# Altium schematic sheet ANALOG.SchDoc: ANALOG
size A3; CheckedBy: HungDV; DrawnBy: HungDV; SheetNumber: 4; SheetTotal: 5
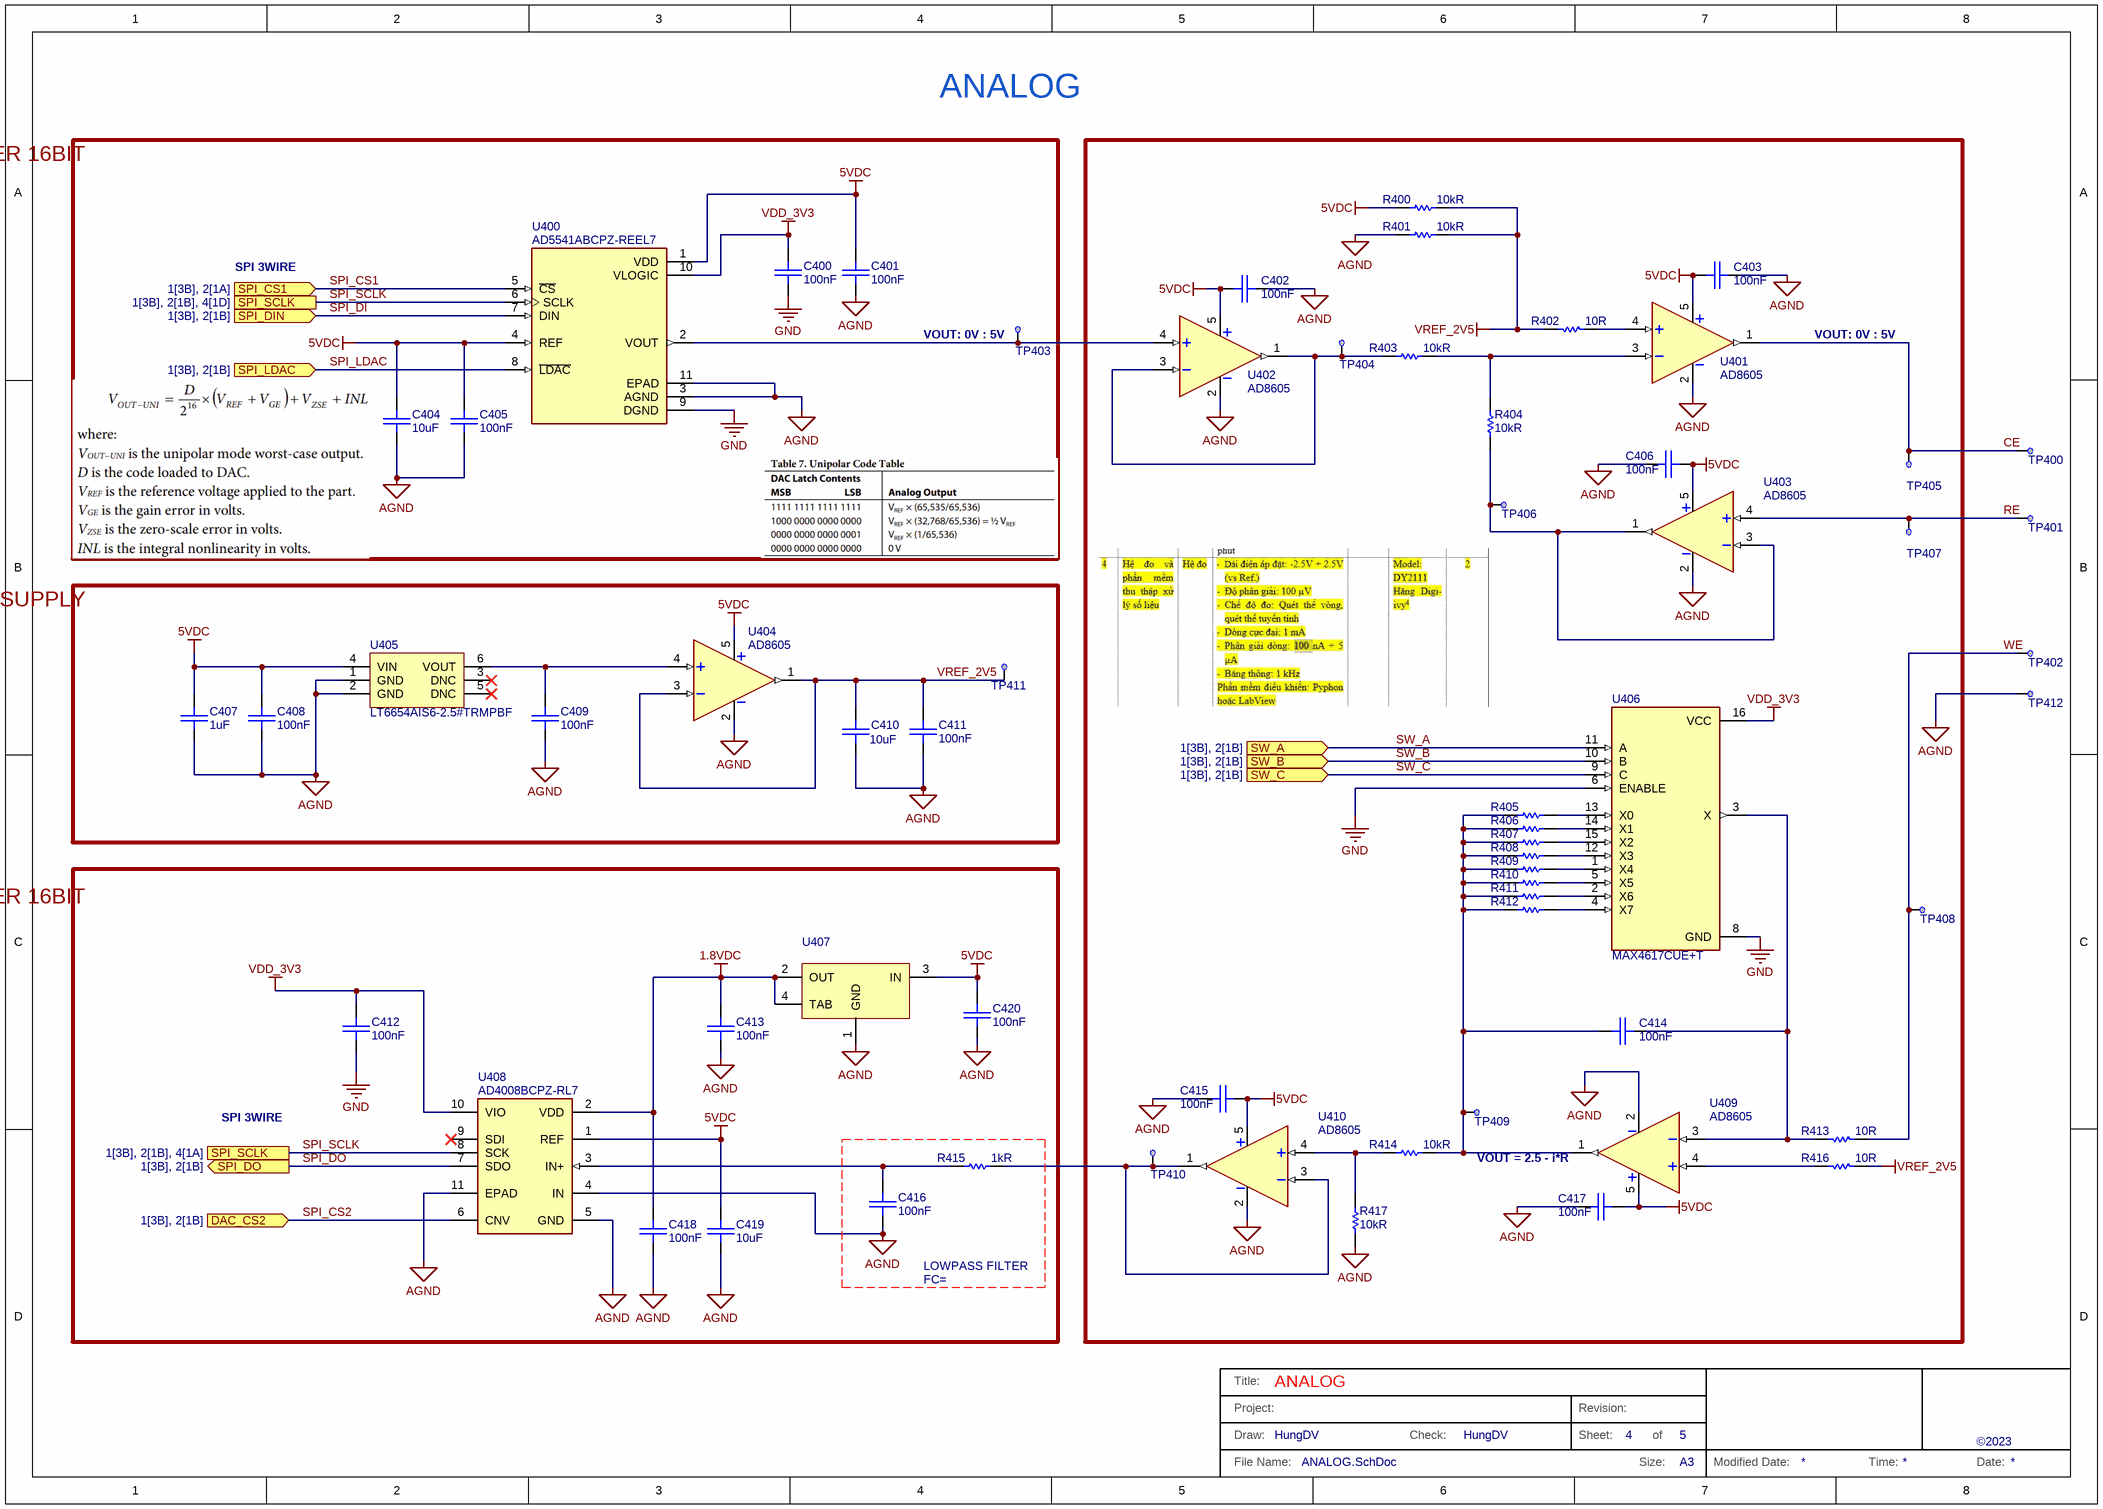
[diagram p0: ANALOG.SchDoc]

## Parts
C400  100nF  [CAP0603-M]
C401  100nF  [CAP0603-M]
C402  100nF  [CAP0603-M]
C403  100nF  [CAP0603-M]
C404  10uF  [CAP0603-M]
C405  100nF  [CAP0603-M]
C406  100nF  [CAP0603-M]
C407  Capacitance: 1uF  [CAP0603-M]  (hidden comment: 10uF)
C408  100nF  [CAP0603-M]
C409  100nF  [CAP0603-M]
C410  10uF  [CAP0603-M]
C411  100nF  [CAP0603-M]
C412  100nF  [CAP0603-M]
C413  100nF  [CAP0603-M]
C414  100nF  [CAP0603-M]
C415  100nF  [CAP0603-M]
C416  100nF  [CAP0603-M]
C417  100nF  [CAP0603-M]
C418  100nF  [CAP0603-M]
C419  10uF  [CAP0603-M]
C420  100nF  [CAP0603-M]
R400  10kR  [R_0603]
R401  10kR  [R_0603]
R402  10R  [R_0603]
R403  10kR  [R_0603]
R404  10kR  [R_0603]
R405  RES 11.3K OHM 1% 1/20W 0201  [R_0603]  (value not drawn)
R406  RES 11.3K OHM 1% 1/20W 0201  [R_0603]  (value not drawn)
R407  RES 11.3K OHM 1% 1/20W 0201  [R_0603]  (value not drawn)
R408  RES 11.3K OHM 1% 1/20W 0201  [R_0603]  (value not drawn)
R409  RES 11.3K OHM 1% 1/20W 0201  [R_0603]  (value not drawn)
R410  RES 11.3K OHM 1% 1/20W 0201  [R_0603]  (value not drawn)
R411  RES 11.3K OHM 1% 1/20W 0201  [R_0603]  (value not drawn)
R412  RES 11.3K OHM 1% 1/20W 0201  [R_0603]  (value not drawn)
R413  10R  [R_0603]
R414  10kR  [R_0603]
R415  1kR  [R_0603]
R416  10R  [R_0603]
R417  10kR  [R_0603]
TP400  SIREN_EN  [TPH]  (value not drawn)  (no BOM)
TP401  SIREN_EN  [TPH]  (value not drawn)  (no BOM)
TP402  SIREN_EN  [TPH]  (value not drawn)  (no BOM)
TP403  VDAC  [TPH]  (value not drawn)  (no BOM)
TP404  V1  [TPH]  (value not drawn)  (no BOM)
TP405  VCE  [TPH]  (value not drawn)  (no BOM)
TP406  VREFB  [TPH]  (value not drawn)  (no BOM)
TP407  VRE  [TPH]  (value not drawn)  (no BOM)
TP408  VWE  [TPH]  (value not drawn)  (no BOM)
TP409  VIR  [TPH]  (value not drawn)  (no BOM)
TP410  VADC  [TPH]  (value not drawn)  (no BOM)
TP411  VREF  [TPH]  (value not drawn)  (no BOM)
TP412  SIREN_EN  [TPH]  (value not drawn)  (no BOM)
U400  AD5541ABCPZ-REEL7  [SON50P300X300X80-11N]
U401  AD8605  [SOT95P280X145-5N]
U402  AD8605  [SOT95P280X145-5N]
U403  AD8605  [SOT95P280X145-5N]
U404  AD8605  [SOT95P280X145-5N]
U405  LT6654AIS6-2.5#TRMPBF  [SOT95P280X145-6N]
U406  MAX4617CUE+T  [TSOP65P640X110-16N]
U407  LM1117-3.3  [SOT223-4]  (value not drawn)
U408  AD4008BCPZ-RL7  [SON50P300X300X80-11N]
U409  AD8605  [SOT95P280X145-5N]
U410  AD8605  [SOT95P280X145-5N]

## Blocks framed on the sheet
DAC CONVERTER 16BIT: C400 C401 C404 C405 TP403 U400
VREF POWER SUPPLY: C407-C411 TP411 U404 U405
ADC CONVERTER 16BIT: C412 C413 C416 C418-C420 R415 U407 U408

## Ports
DAC_CS2 (in, see 1[3B], 2[1B]), SPI_CS1 (in, see 1[3B], 2[1A]), SPI_DIN (in, see 1[3B], 2[1B]), SPI_DO (out, see 1[3B], 2[1B]), SPI_LDAC (in, see 1[3B], 2[1B]), SPI_SCLK (see 1[3B], 2[1B], 4[1A]), SPI_SCLK (see 1[3B], 2[1B], 4[1D]), SW_A (in, see 1[3B], 2[1B]), SW_B (in, see 1[3B], 2[1B]), SW_C (in, see 1[3B], 2[1B])

## Nets
1.8VDC: C413.2 C418.2 U407.2(OUT) U407.4(TAB) U408.2(VDD)
5VDC: C401.2 C402.2 C403.2 C404.2 C405.2 C406.2 C407.2 C408.2 C415.2 C417.2 C419.2 C420.2 R400.2 U400.1(VDD) U400.4(REF) U401.5(V+) U402.5(V+) U403.5(V+) U404.5(V+) U405.4(VIN) U407.3(IN) U408.1(REF) U409.5(V+) U410.5(V+)
AGND: C401.1 C402.1 C403.1 C404.1 C405.1 C406.1 C407.1 C408.1 C409.1 C410.1 C411.1 C413.1 C415.1 C416.1 C417.1 C418.1 C419.1 C420.1 R401.2 R417.2 TP412.1(TP) U400.3(AGND) U400.11(EPAD) U401.2(V-) U402.2(V-) U403.2(V-) U404.2(V-) U405.1(GND) U405.2(GND) U407.1(GND) U408.4(IN) U408.5(GND) U408.11(EPAD) U409.2(V-) U410.2(V-)
GND: C400.1 C412.1 U400.9(DGND) U406.6(ENABLE) U406.8(GND)
VDD_3V3: C400.2 C412.2 U400.10(VLOGIC) U406.16(VCC) U408.10(VIO)
VREF_2V5: C410.2 C411.2 R400.1 R401.1 R402.1 R416.2 TP411.1(TP) U404.1(OUT) U404.3(+IN)
CE: TP400.1(TP) TP405.1(TP) U401.1(OUT)
RE: TP401.1(TP) TP407.1(TP) U403.4(-IN)
SPI_CS1: U400.5(~{CS}) ; port SPI_CS1
SPI_CS2: U408.6(CNV) ; port DAC_CS2
SPI_DI: U400.7(DIN) ; port SPI_DIN
SPI_DO: U408.7(SDO) ; port SPI_DO
SPI_LDAC: U400.8(~{LDAC}) ; port SPI_LDAC
SPI_SCLK: U400.6(SCLK) U408.8(SCK) ; port SPI_SCLK
SW_A: U406.11(A) ; port SW_A
SW_B: U406.10(B) ; port SW_B
SW_C: U406.9(C) ; port SW_C
WE: R413.2 TP402.1(TP) TP408.1(TP)
NetC409_2: C409.2 U404.4(-IN) U405.6(VOUT)
NetC414_1: C414.1 R413.1 U406.3(X) U409.3(+IN)
NetC414_2: C414.2 R405.2 R406.2 R407.2 R408.2 R409.2 R410.2 R411.2 R412.2 R414.1 TP409.1(TP) U409.1(OUT)
NetC416_2: C416.2 R415.2 U408.3(IN+)
NetR402_2: R402.2 U401.4(-IN)
NetR403_1: R403.1 R404.1 U401.3(+IN)
NetR403_2: R403.2 TP404.1(TP) U402.1(OUT) U402.3(+IN)
NetR404_2: R404.2 TP406.1(TP) U403.1(OUT) U403.3(+IN)
NetR405_1: R405.1 U406.13(X0)
NetR406_1: R406.1 U406.14(X1)
NetR407_1: R407.1 U406.15(X2)
NetR408_1: R408.1 U406.12(X3)
NetR409_1: R409.1 U406.1(X4)
NetR410_1: R410.1 U406.5(X5)
NetR411_1: R411.1 U406.2(X6)
NetR412_1: R412.1 U406.4(X7)
NetR414_2: R414.2 R417.1 U410.4(-IN)
NetR415_1: R415.1 TP410.1(TP) U410.1(OUT) U410.3(+IN)
NetR416_1: R416.1 U409.4(-IN)
NetTP403_1: TP403.1(TP) U400.2(VOUT) U402.4(-IN)

Not connected (* = marked no-connect by the designer): U405 3(DNC)* 5(DNC)*; U408 9(SDI)*

## Notes on the sheet
- SPI 3WIRE
- (near TP403) VOUT: 0V : 5V
- VOUT: 0V : 5V
- VOUT = 2.5 - i*R
- FC=
- LOWPASS FILTER
- Title:
- Project:
- Draw:
- Check:
- Revision:
- Sheet:
- of
- ©2023
- File Name:
- Size:
- A3
- Modified Date:
- Time:
- Date:

## Library data of the parts
C400-C403 C405 C406 C408 C409 C411-C418 C420 = CAP_10uF_0402: CAP CER 100nF 16V X5R 0603; Manufacturer 1: Samsung; Manufacturer Part Number 1: CL05A106MP8NUB8; Revision: 2; Manufacturer 2: Murata; Manufacturer Part Number 2: GRM155R61A106ME11D; Capacitance: 100nF
C404 C410 = CAP_10uF_0402: CAP CER 10UF 16V X5R 0603; Manufacturer Part Number 1: CL05A106MP8NUB8; Manufacturer 1: Samsung; Revision: 2; Manufacturer 2: Murata; Manufacturer Part Number 2: GRM155R61A106ME11D; Capacitance: 10uF
C407 C419 = CAP_10uF_0402: CAP CER 10UF 16V X5R 0603; Manufacturer 1: Samsung; Manufacturer Part Number 1: CL05A106MP8NUB8; Revision: 2; Manufacturer 2: Murata; Manufacturer Part Number 2: GRM155R61A106ME11D
  C419: Capacitance: 10uF
R400 R401 R403 R404 R414 R417 = RES_10K_0201: RES SMD 10K OHM 1% 1/8W 0603; Manufacturer 1: Yageo; Manufacturer Part Number 1: RC0201FR-0711K3L; Revision: 1; Manufacturer 2: Panasonic Electronic Components
R402 R413 R416 = RES_10K_0201: RES SMD 10R OHM 1% 1/8W 0603; Manufacturer 1: Yageo; Manufacturer Part Number 1: RC0201FR-0711K3L; Revision: 1; Manufacturer 2: Panasonic Electronic Components
R405-R412 = RES_10K_0201: 11.3kOhms ±1% 0.05W, 1/20W Chip Resistor 0201 (0603 Metric) Moisture Resistant Thick Film; Manufacturer 1: Yageo; Manufacturer Part Number 1: RC0201FR-0711K3L; Revision: 1; Manufacturer 2: Panasonic Electronic Components
R415 = RES_10K_0201: RES SMD 1K OHM 1% 1/8W 0603; Manufacturer 1: Yageo; Manufacturer Part Number 1: RC0201FR-0711K3L; Revision: 1; Manufacturer 2: Panasonic Electronic Components
TP400-TP412 = S1400-000002: Test_Point_1mm; Footprint: TP_1mm
U400 = AD5541ABCPZ-REEL7: 2.7 V to 5.5 V, Serial-Input, Voltage-Output, 16-/12-Bit nanoDACÂ™ in 8-lead 3 mm Ã— 3 mm LFCSP; Manufacturer Part Number 1: AD5541ABCPZ-REEL7
U401-U404 U409 U410 = AD8605: IC OPAMP GP 1 CIRCUIT SOT23-5; Manufacturer Part Number 1: AD8605
U405 = LT6654AIS6-2.5#TRMPBF: IC VREF SERIES 0.05% TSOT23-6; Manufacturer Part Number 1: LT6654AIS6-2.5#TRMPBF
U406 = MAX4617CUE+: IC MUX 8:1 10OHM 16TSSOP; Manufacturer Part Number 1: MAX4617CUE+T
U407 = S1001-000002: IC REG LINEAR 3.3V 1A SOT223; Manufacturer: DIODE; Component Kind: Standard; Manufacturer Part Number 1: LM1117-3.3
U408 = AD4008BCPZ-RL7: No Description Available; Manufacturer Part Number 1: AD4008BCPZ-RL7